# EAGLE design ADF Copy v0.5 (EAGLE 9.1.0)
CNAME: AKSevenFour; CREVISION: 0.4; DESIGNER: Adam Keher

## Sheet 1 of 4: Floppy Controller
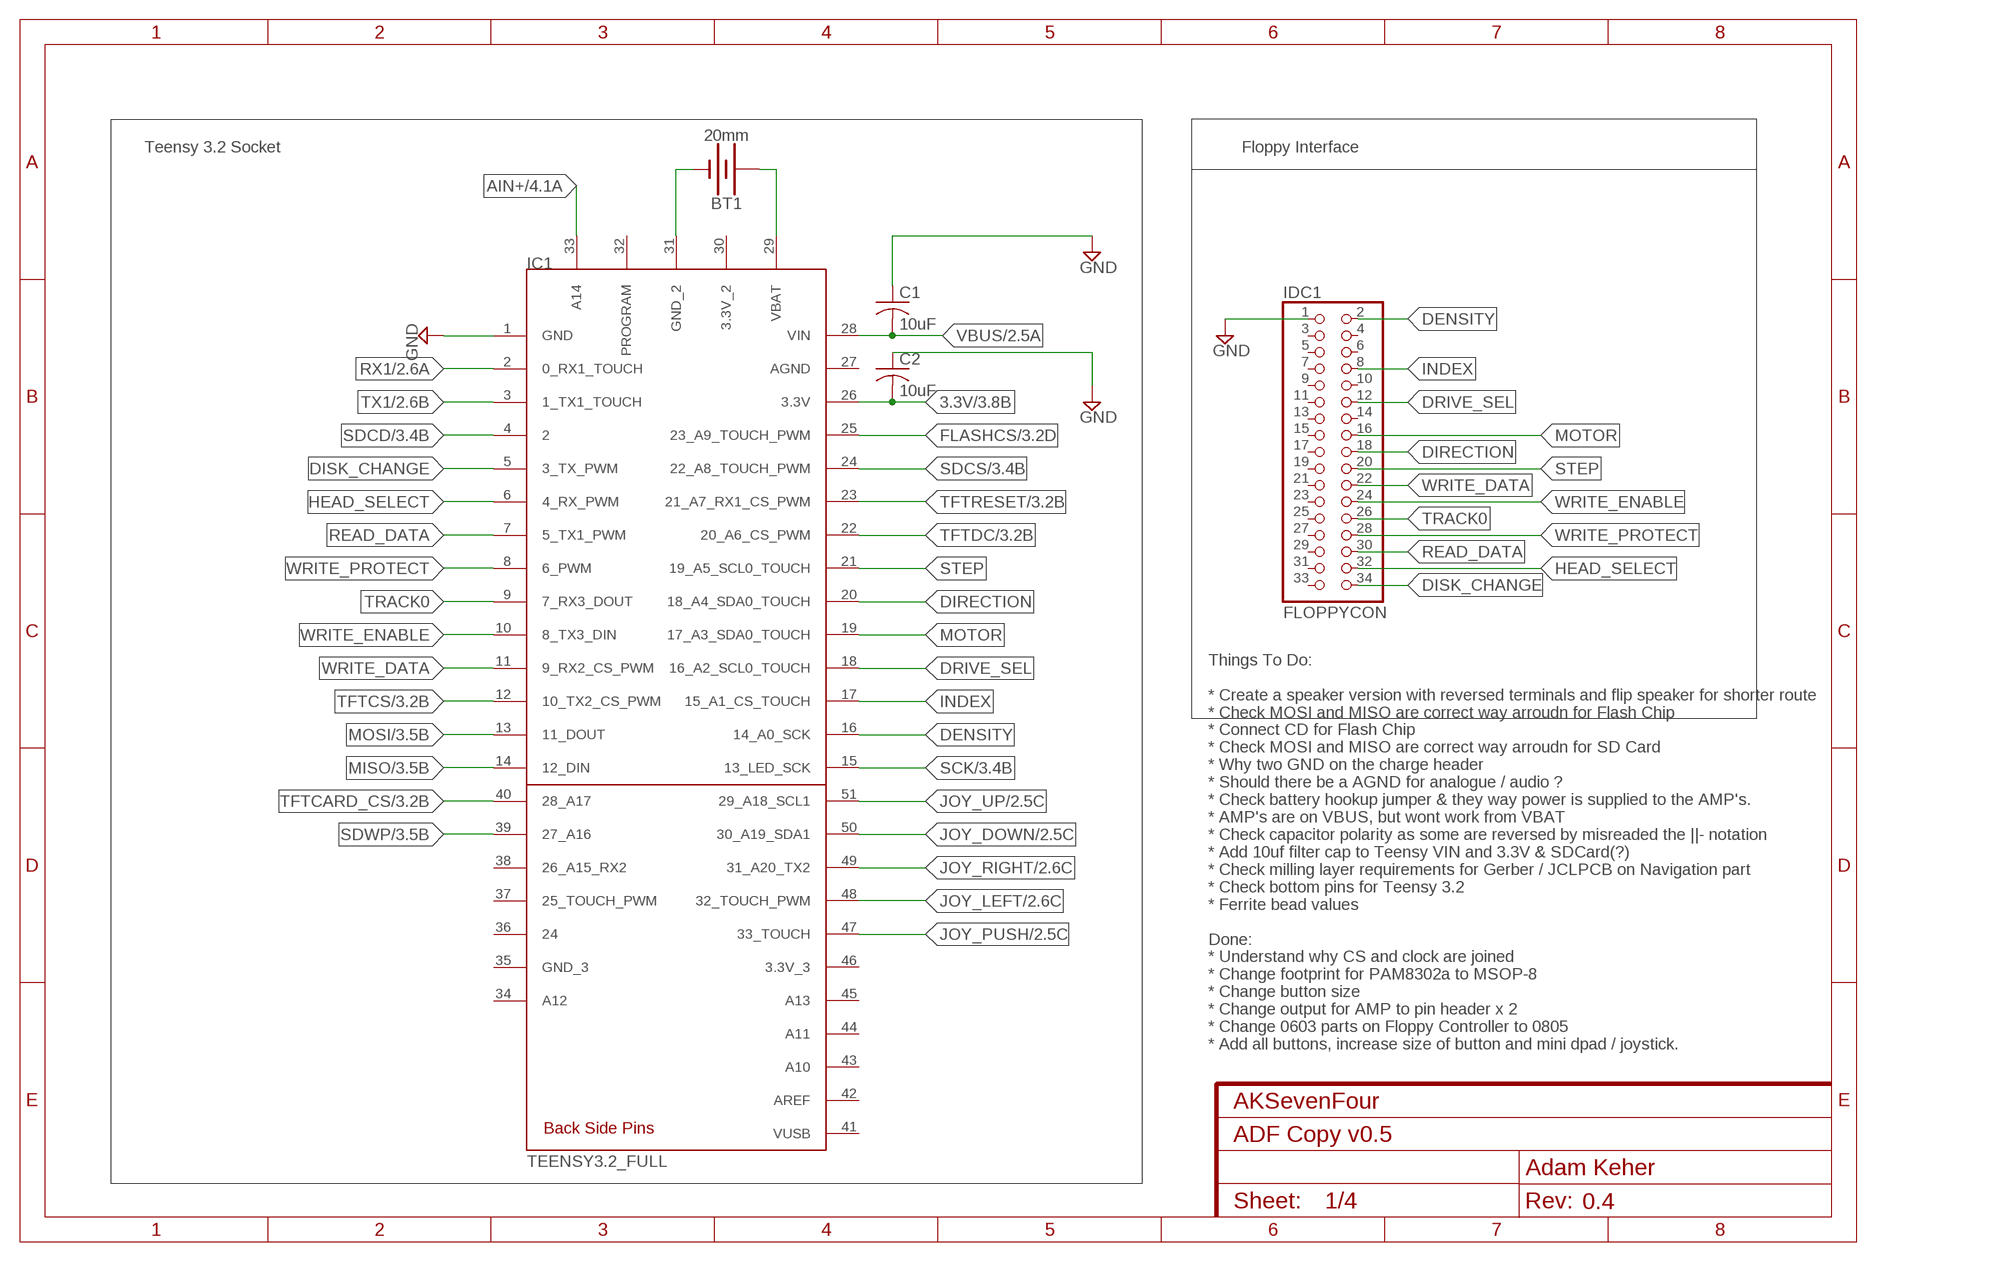
[diagram p0: schematic, sheet 1]

### Parts
BT1  20mm  BATTERY-20MM_PTH  [BATTCOM_20MM_PTH]
C1  10uF  C-USC0805  [C0805]
C2  10uF  C-USC0805  [C0805]
IC1  TEENSY3.2_FULL  [DIP28X4-2.54-34.7X15.24MM]
IDC1  FLOPPYCON  [2X17/90]

### Nets
3.3V [power1]: C2.2 IC1.26(3.3V) ; also sheet 3
AIN+: IC1.33(A14) ; also sheet 4
DENSITY: IC1.16(14_A0_SCK) IDC1.2
DIRECTION: IC1.20(18_A4_SDA0_TOUCH) IDC1.18
DISK_CHANGE: IC1.5(3_TX_PWM) IDC1.34
DRIVE_SEL: IC1.18(16_A2_SCL0_TOUCH) IDC1.12
FLASHCS: IC1.25(23_A9_TOUCH_PWM) ; also sheet 3
GND: C1.1 C2.1 IC1.1(GND) IDC1.1 ; also sheet 2,3,4
HEAD_SELECT: IC1.6(4_RX_PWM) IDC1.32
INDEX: IC1.17(15_A1_CS_TOUCH) IDC1.8
JOY_DOWN: IC1.50(30_A19_SDA1) ; also sheet 2
JOY_LEFT: IC1.48(32_TOUCH_PWM) ; also sheet 2
JOY_PUSH: IC1.47(33_TOUCH) ; also sheet 2
JOY_RIGHT: IC1.49(31_A20_TX2) ; also sheet 2
JOY_UP: IC1.51(29_A18_SCL1) ; also sheet 2
MISO: IC1.14(12_DIN) ; also sheet 3
MOSI: IC1.13(11_DOUT) ; also sheet 3
MOTOR: IC1.19(17_A3_SDA0_TOUCH) IDC1.16
N$7: BT1.2(-) IC1.31(GND_2)
N$8: BT1.1(+) IC1.29(VBAT)
READ_DATA: IC1.7(5_TX1_PWM) IDC1.30
RX1: IC1.2(0_RX1_TOUCH) ; also sheet 2
SCK: IC1.15(13_LED_SCK) ; also sheet 3
SDCD: IC1.4 ; also sheet 3
SDCS: IC1.24(22_A8_TOUCH_PWM) ; also sheet 3
SDWP: IC1.39(27_A16) ; also sheet 3
STEP: IC1.21(19_A5_SCL0_TOUCH) IDC1.20
TFTCARD_CS: IC1.40(28_A17) ; also sheet 3
TFTCS: IC1.12(10_TX2_CS_PWM) ; also sheet 3
TFTDC: IC1.22(20_A6_CS_PWM) ; also sheet 3
TFTRESET: IC1.23(21_A7_RX1_CS_PWM) ; also sheet 3
TRACK0: IC1.9(7_RX3_DOUT) IDC1.26
TX1: IC1.3(1_TX1_TOUCH) ; also sheet 2
VBUS [power2]: C1.2 IC1.28(VIN) ; also sheet 2,4
WRITE_DATA: IC1.11(9_RX2_CS_PWM) IDC1.22
WRITE_ENABLE: IC1.10(8_TX3_DIN) IDC1.24
WRITE_PROTECT: IC1.8(6_PWM) IDC1.28
Unconnected: IC1.27(AGND) IC1.30(3.3V_2) IC1.32(PROGRAM) IC1.34(A12) IC1.35(GND_3) IC1.36 IC1.37(25_TOUCH_PWM) IC1.38(26_A15_RX2) IC1.41(VUSB) IC1.42(AREF) IC1.43(A10) IC1.44(A11) IC1.45(A13) IC1.46(3.3V_3) IDC1.3 IDC1.4 IDC1.5 IDC1.6 IDC1.7 IDC1.9 IDC1.10 IDC1.11 IDC1.13 IDC1.14 IDC1.15 IDC1.17 IDC1.19 IDC1.21 IDC1.23 IDC1.25 IDC1.27 IDC1.29 IDC1.31 IDC1.33

### Notes on the sheet
- Teensy 3.2 Socket | Floppy Interface
- Things To Do:
  
  * Create a speaker version with reversed terminals and flip speaker for shorter route
  * Check MOSI and MISO are correct way arroudn for Flash Chip
  * Connect CD for Flash Chip
  * Check MOSI and MISO are correct way arroudn for SD Card
  * Why two GND on the charge header
  * Should there be a AGND for analogue / audio ?
  * Check battery hookup jumper & they way power is supplied to the AMP's.
  * AMP's are on VBUS, but wont work from VBAT
  * Check capacitor polarity as some are reversed by misreaded the ||- notation
  * Add 10uf filter cap to Teensy VIN and 3.3V & SDCard(?)
  * Check milling layer requirements for Gerber / JCLPCB on Navigation part
  * Check bottom pins for Teensy 3.2
  * Ferrite bead values
  
  Done:
  * Understand why CS and clock are joined
  * Change footprint for PAM8302a to MSOP-8
  * Change button size
  * Change output for AMP to pin header x 2
  * Change 0603 parts on Floppy Controller to 0805
  * Add all buttons, increase size of button and mini dpad / joystick.

## Sheet 2 of 4: Jumpers
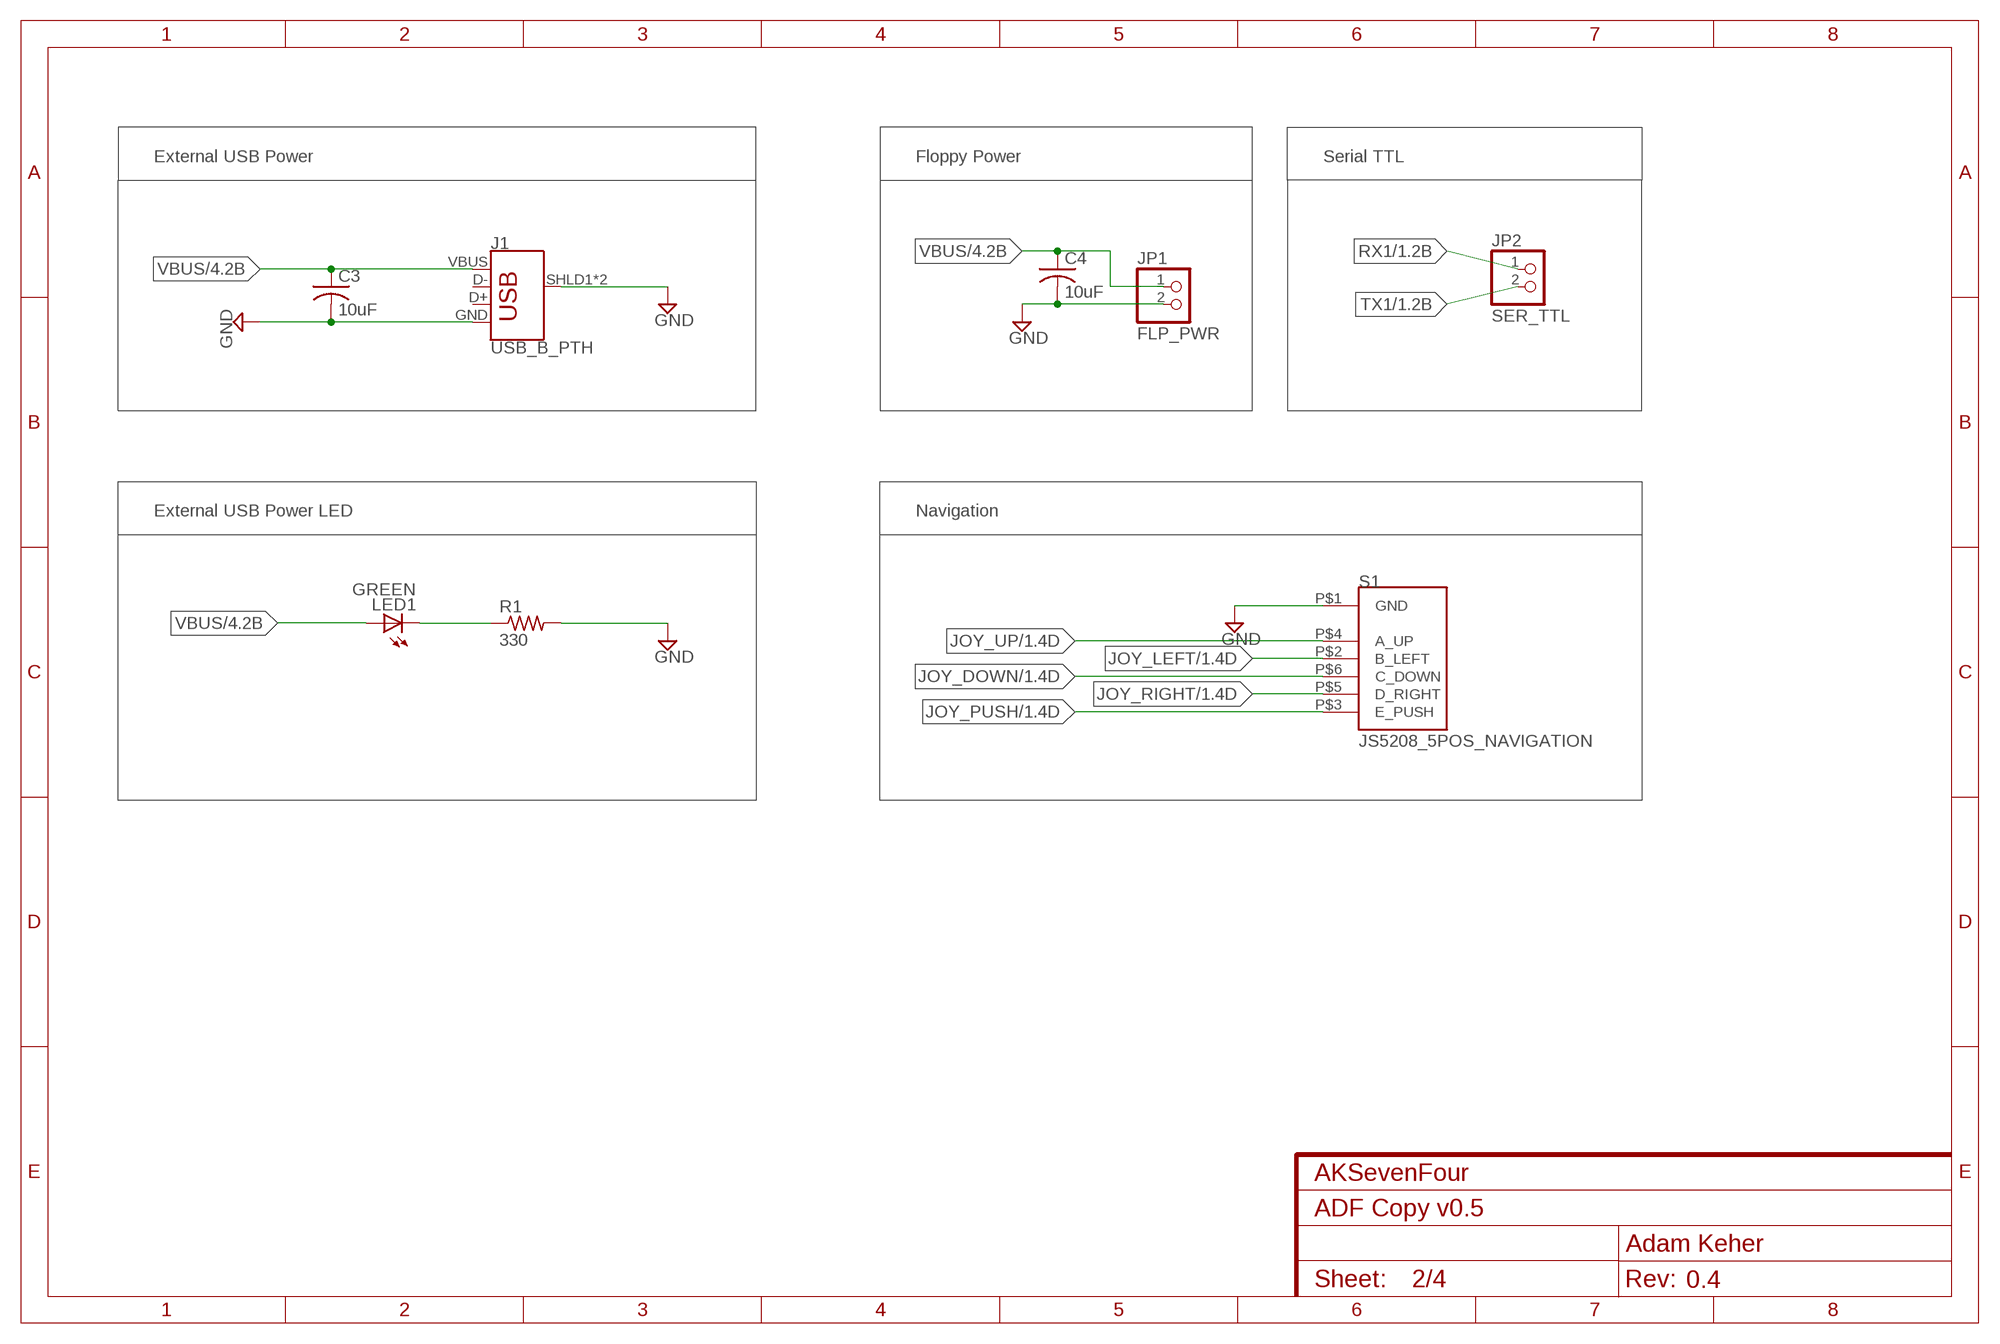
[diagram p1: schematic, sheet 2]

### Parts
C3  10uF  C-USC0805  [C0805]
C4  10uF  C-USC0805  [C0805]
J1  USB_B_PTH  [USB-B-PTH]
JP1  FLP_PWR  PINHD-1X2  [1X02]
JP2  SER_TTL  PINHD-1X2  [1X02]
LED1  GREEN  LEDCHIP-LED0805  [CHIP-LED0805]
R1  330  R-US_R0805  [R0805]
S1  JS5208_5POS_NAVIGATION  [JS5208_5POS_NAVIGATION]

### Nets
GND: C3.2 C4.2 J1.GND J1.SHLD1(SHIELD) J1.SHLD2(SHIELD) JP1.2 R1.2 S1.P$1(GND) ; also sheet 1,3,4
JOY_DOWN: S1.P$6(C_DOWN) ; also sheet 1
JOY_LEFT: S1.P$2(B_LEFT) ; also sheet 1
JOY_PUSH: S1.P$3(E_PUSH) ; also sheet 1
JOY_RIGHT: S1.P$5(D_RIGHT) ; also sheet 1
JOY_UP: S1.P$4(A_UP) ; also sheet 1
N$1: LED1.C R1.1
RX1: JP2.1 ; also sheet 1
TX1: JP2.2 ; also sheet 1
VBUS [power2]: C3.1 C4.1 J1.VBUS JP1.1 LED1.A ; also sheet 1,4
Unconnected: J1.D+ J1.D-

### Notes on the sheet
- External USB Power | Floppy Power | Serial TTL
- External USB Power LED | Navigation

## Sheet 3 of 4: TFT, SPI Flash & SD Card Reader
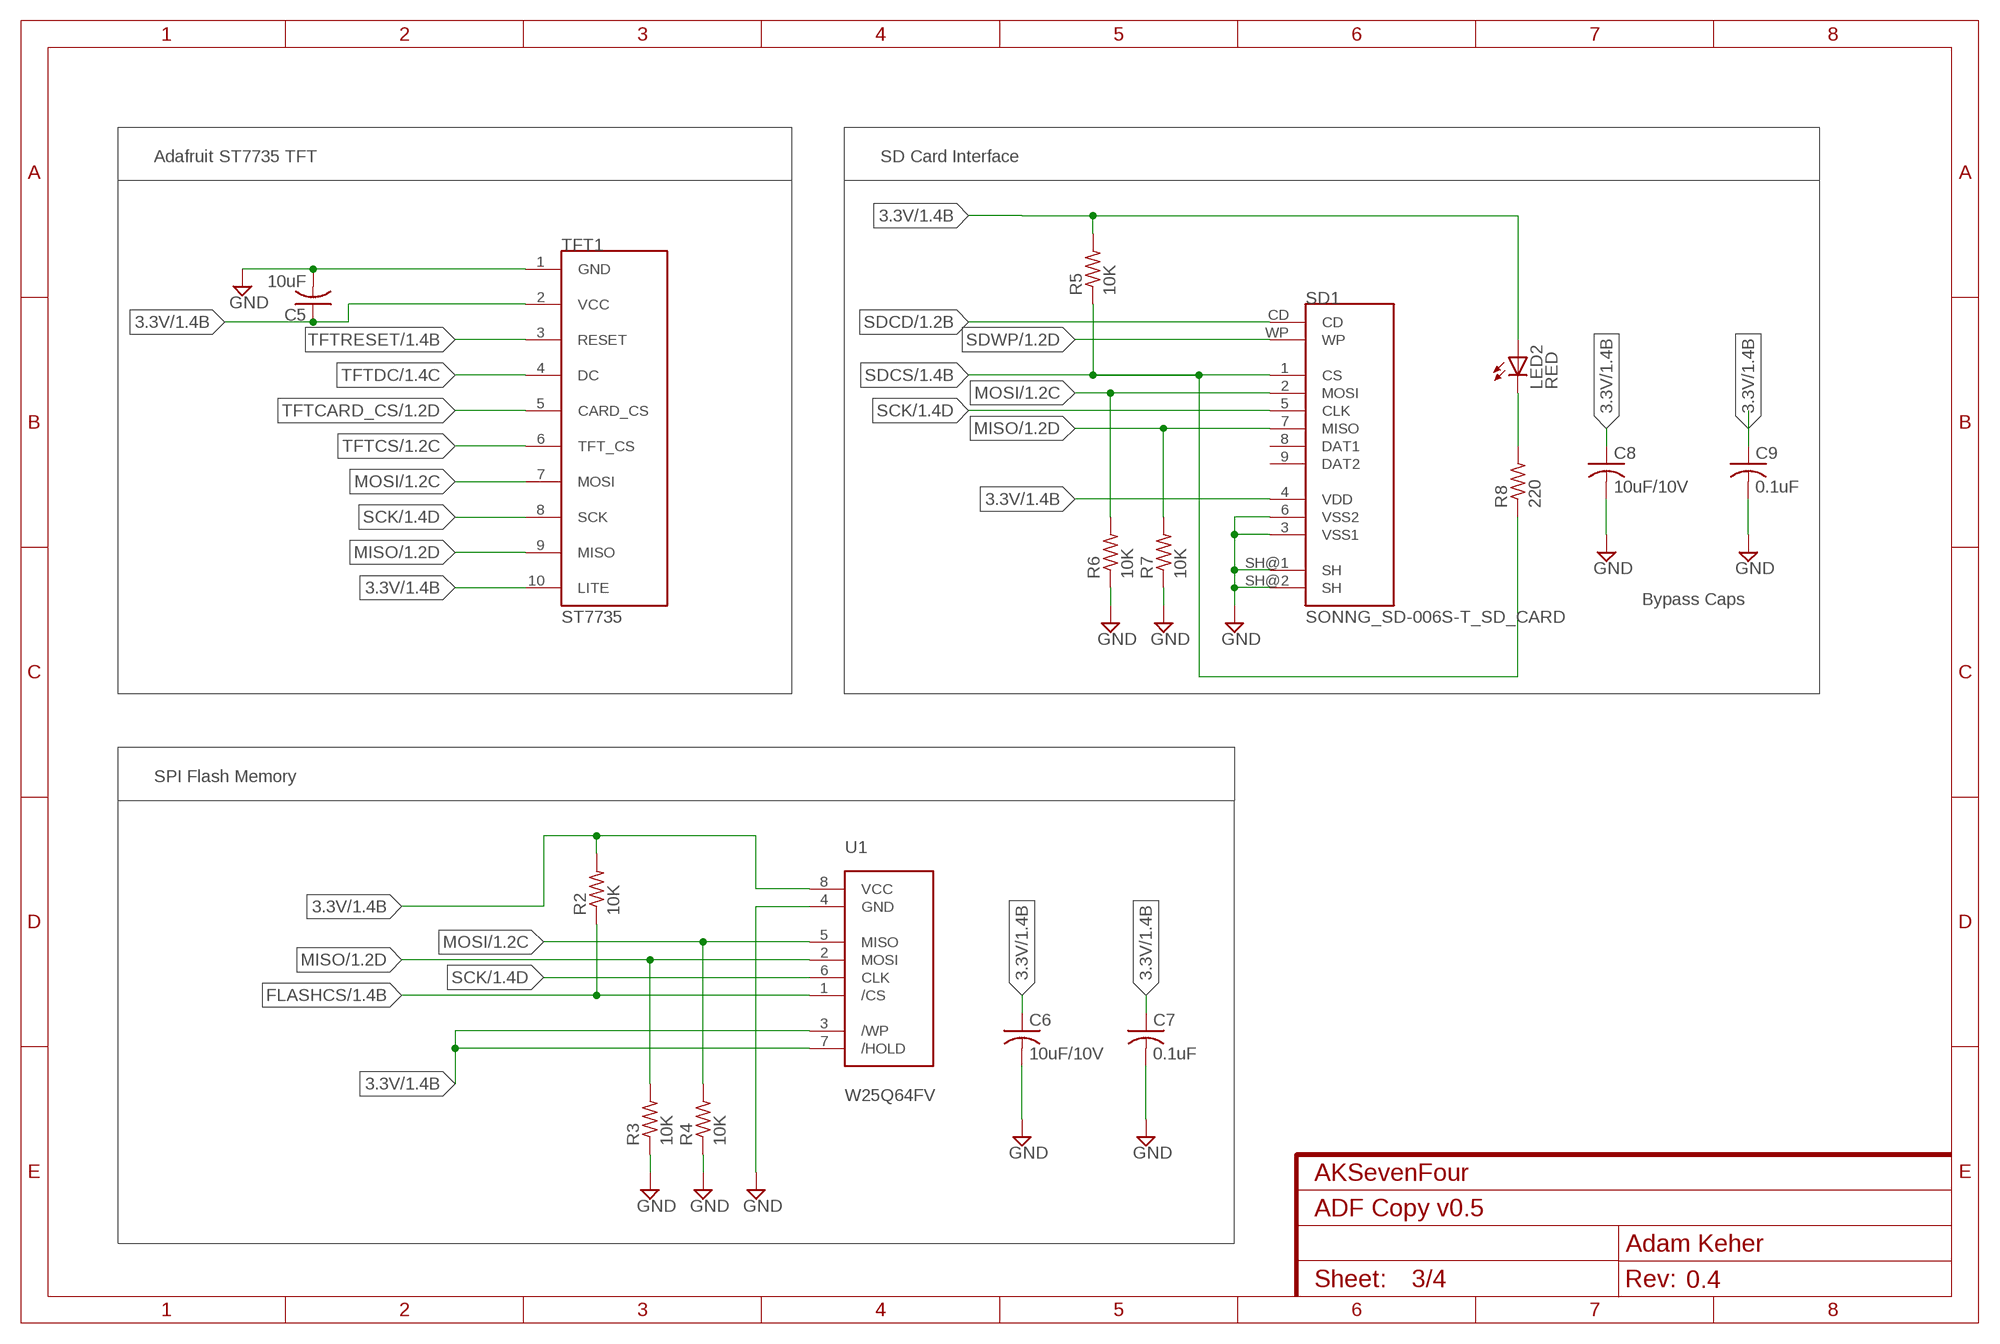
[diagram p2: schematic, sheet 3]

### Parts
C5  10uF  C-USC0805  [C0805]
C6  10uF/10V  C-USC0805  [C0805]
C7  0.1uF  C-USC0805  [C0805]
C8  10uF/10V  C-USC0805  [C0805]
C9  0.1uF  C-USC0805  [C0805]
LED2  RED  LEDCHIP-LED0805  [CHIP-LED0805]
R2  10K  R-US_R0805  [R0805]
R3  10K  R-US_R0805  [R0805]
R4  10K  R-US_R0805  [R0805]
R5  10K  R-US_R0805  [R0805]
R6  10K  R-US_R0805  [R0805]
R7  10K  R-US_R0805  [R0805]
R8  220  R-US_R0805  [R0805]
SD1  SONNG_SD-006S-T_SD_CARD  [SD-006S-T]
TFT1  ST7735  [ST7735]
U1  W25Q64FV  [SOIC8]

### Nets
3.3V [power1]: C5.1 C6.1 C7.1 C8.1 C9.1 LED2.A R2.2 R5.2 SD1.4(VDD) TFT1.2(VCC) TFT1.10(LITE) U1.3(/WP) U1.7(/HOLD) U1.8(VCC) ; also sheet 1
FLASHCS: R2.1 U1.1(/CS) ; also sheet 1
GND: C5.2 C6.2 C7.2 C8.2 C9.2 R3.1 R4.1 R6.1 R7.1 SD1.3(VSS1) SD1.6(VSS2) SD1.SH@1(SH) SD1.SH@2(SH) TFT1.1(GND) U1.4(GND) ; also sheet 1,2,4
MISO: R3.2 R7.2 SD1.7(MISO) TFT1.9(MISO) U1.2(MOSI) ; also sheet 1
MOSI: R4.2 R6.2 SD1.2(MOSI) TFT1.7(MOSI) U1.5(MISO) ; also sheet 1
N$15: LED2.C R8.2
SCK: SD1.5(CLK) TFT1.8(SCK) U1.6(CLK) ; also sheet 1
SDCD: SD1.CD ; also sheet 1
SDCS: R5.1 R8.1 SD1.1(CS) ; also sheet 1
SDWP: SD1.WP ; also sheet 1
TFTCARD_CS: TFT1.5(CARD_CS) ; also sheet 1
TFTCS: TFT1.6(TFT_CS) ; also sheet 1
TFTDC: TFT1.4(DC) ; also sheet 1
TFTRESET: TFT1.3(RESET) ; also sheet 1
Unconnected: SD1.8(DAT1) SD1.9(DAT2)

### Notes on the sheet
- Adafruit ST7735 TFT | SD Card Interface
- Bypass Caps
- SPI Flash Memory

## Sheet 4 of 4: Mono Amplifier
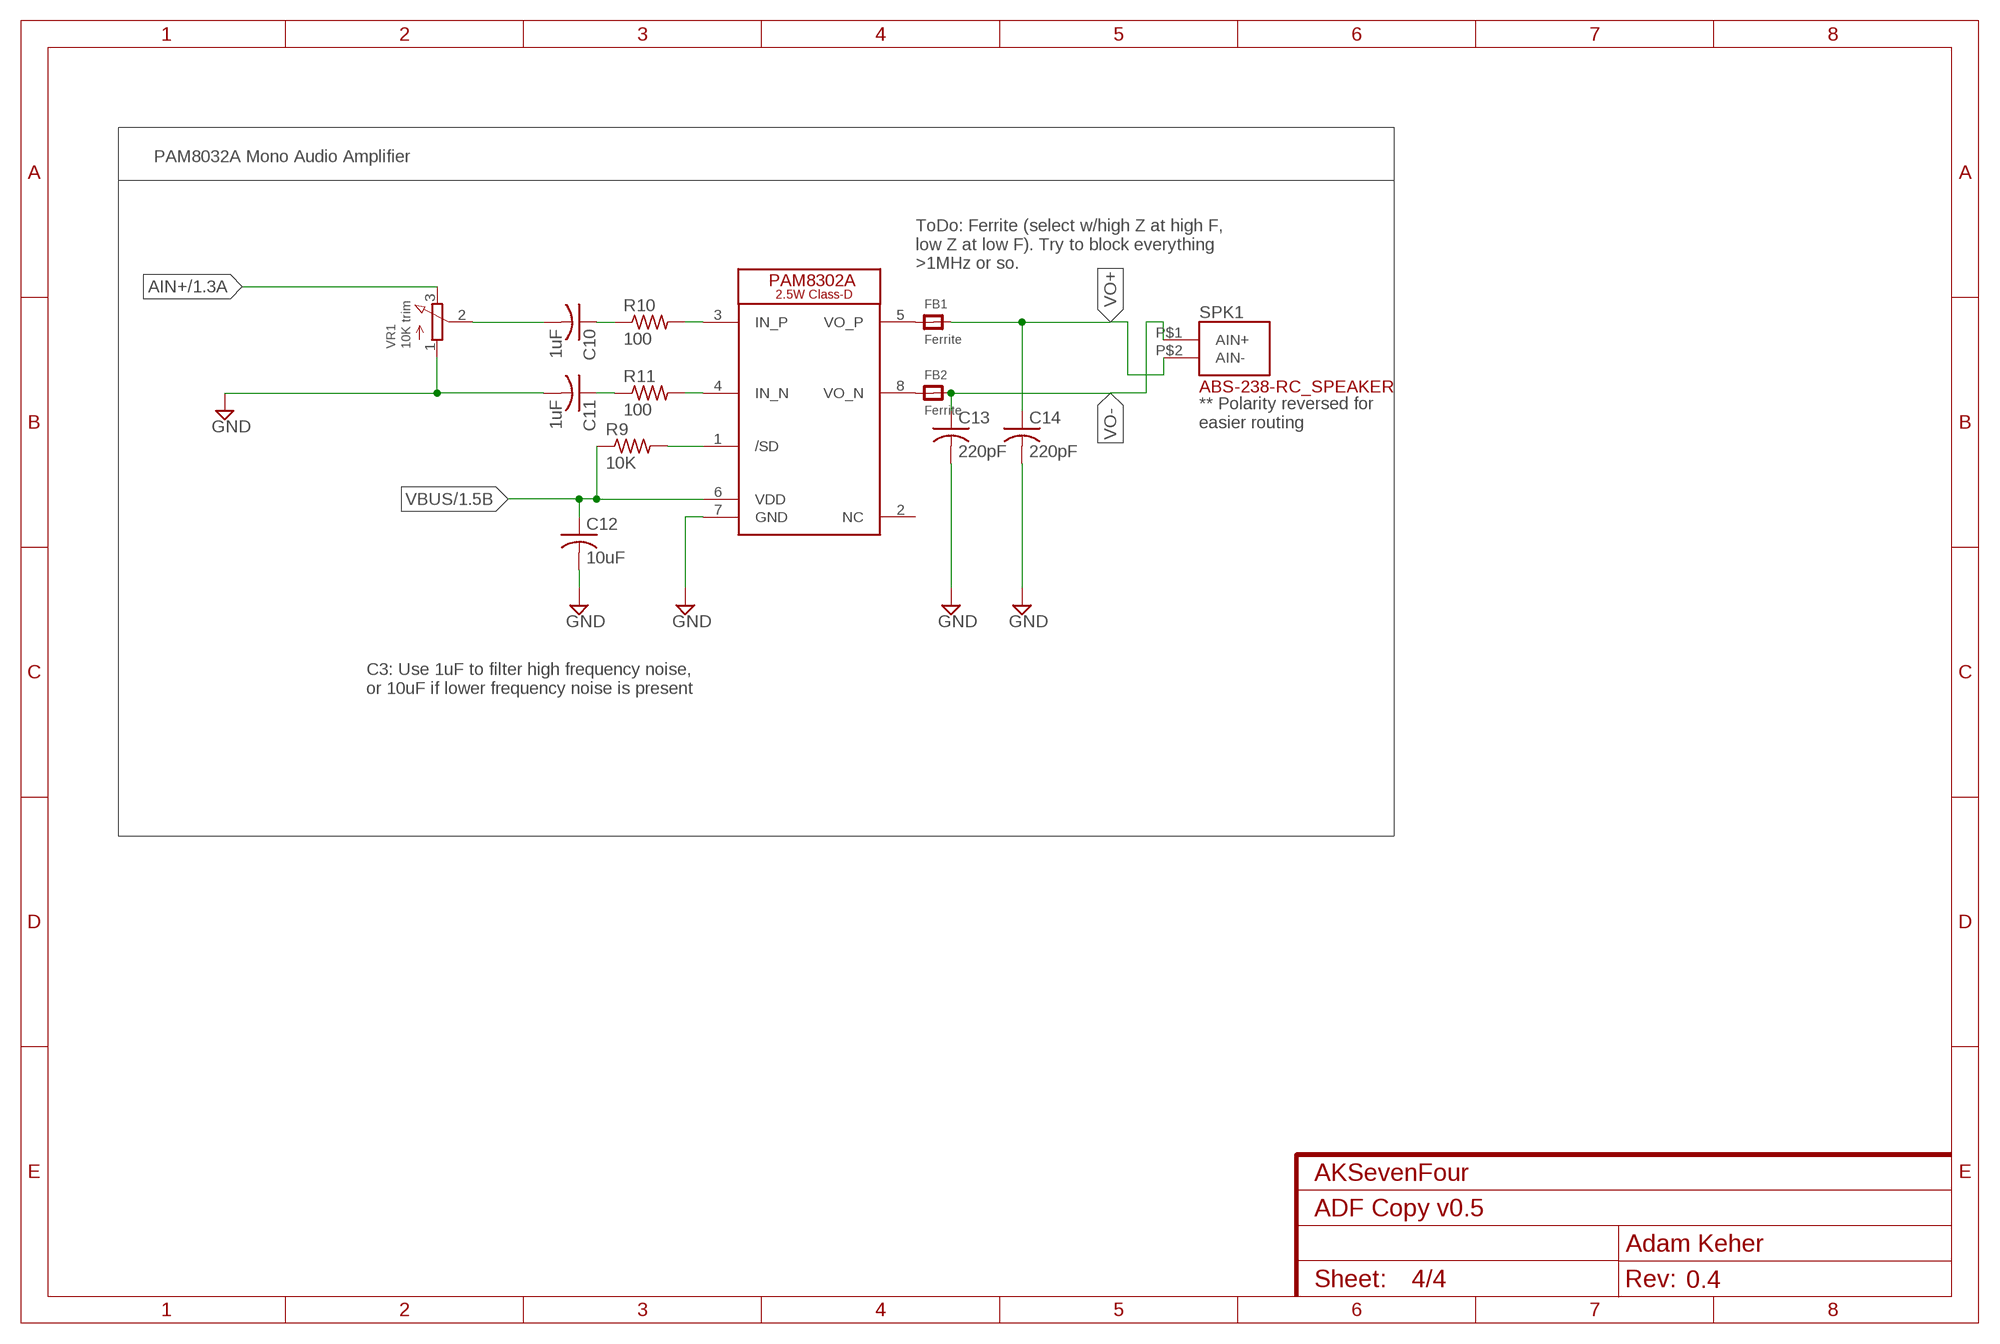
[diagram p3: schematic, sheet 4]

### Parts
C10  1uF  C-USC0805  [C0805]
C11  1uF  C-USC0805  [C0805]
C12  10uF  C-USC0805  [C0805]
C13  220pF  C-USC0805  [C0805]
C14  220pF  C-USC0805  [C0805]
FB1  Ferrite  FERRITE_0805  [_0805]
FB2  Ferrite  FERRITE_0805  [_0805]
IC2  PAM8302A  [SOIC8]
R9  10K  R-US_R0805  [R0805]
R10  100  R-US_R0805  [R0805]
R11  100  R-US_R0805  [R0805]
SPK1  ABS-238-RC_SPEAKER  [ABS-238-RC_SPEAKER]
VR1  10K trim  TRIMPOT3303W/X  [TRIMPOT_BOURNS_3303W]

### Nets
AIN+: VR1.3(E) ; also sheet 1
GND: C11.2 C12.2 C13.2 C14.2 IC2.7(GND) VR1.1(A) ; also sheet 1,2,3
N$3: IC2.1(/SD) R9.2
N$4: FB1.1 IC2.5(VO_P)
N$5: FB2.1 IC2.8(VO_N)
N$20: IC2.4(IN_N) R11.2
N$21: IC2.3(IN_P) R10.2
N$22: C11.1 R11.1
N$25: C10.1 R10.1
N$26: C10.2 VR1.2(S)
VBUS [power2]: C12.1 IC2.6(VDD) R9.1 ; also sheet 1,2
VO+: C14.1 FB1.2 SPK1.P$2(AIN-)
VO-: C13.1 FB2.2 SPK1.P$1(AIN+)
Unconnected: IC2.2(NC)

### Notes on the sheet
- PAM8032A Mono Audio Amplifier
- ToDo: Ferrite (select w/high Z at high F,
  low Z at low F). Try to block everything
  >1MHz or so.
- ** Polarity reversed for
  easier routing
- C3: Use 1uF to filter high frequency noise,
  or 10uF if lower frequency noise is present

## Library data of the parts
BT1 = SparkFun-Batteries:BATTERY: Battery - Single Cell A variety of battery chemistries, sizes, and footprints. Device List: 20MM_PTH - Coin Cell Battery Holder - 20mm (PTH) <https://www.sparkfun.com/products/783> 6.8MM_PTH - Coin Cell Battery Holder - 6.8MM(SMD) <https://www.digikey.com/product-detail/en/seiko-instruments/MS621FE-FL11E/728-1057-ND/1889208?WT.srch=1&gclid=CNOQ5a6LzdQCFZS2wAodXCkE0g> 12MM_SMD - Coin Cell Battery Holder - 12mm (SMD) <https://www.sparkfun.com/products/10592> 12MM_PTH - Coin Cell Battery Holder - 12mm (PTH) <https://www.sparkfun.com/products/7948> 20MM_SMD - 20mm Coin Cell Battery Holder (SMD) (2 legs) Used on the Big Time Watch Kit <https://www.sparkfun.com/products/11734> 20MM_SMD_4LEGS - Coin Cell Battery Holder - 20mm (SMD) <https://www.sparkfun.com/products/11892> 20MM_SMD_4LEGS_OVERPASTE - Coin Cell Battery Holder - 20mm (SMD) <https://www.sparkfun.com/products/11892> (Over-paste on the legs) 24.5MM_PTH - Coin Cell Battery Holder - 24.5mm (PTH) <https://www.sparkfun.com/products/8863> 9V - 9V Battery Holder - PC Mount Used on the SparkFun SparkPunk Sound Kit <https://www.sparkfun.com/products/11177> and SparkFun SparkPunk Sequencer Kit <https://www.sparkfun.com/products/12707> 18650 - Battery Holder - 18650 (PTH) <https://www.sparkfun.com/products/13113> AA - Battery Holder - 1xAA (PTH) <https://www.sparkfun.com/products/7949> AAA - Battery Holder - 1xAAA (PTH) <https://www.sparkfun.com/products/12718> AA_KIT - Battery Holder - 1xAA (PTH) <https://www.sparkfun.com/products/7949> Special kit package - pads only have exposed copper on one side of the board. AAA_KIT - Battery Holder - 1xAAA (PTH) <https://www.sparkfun.com/products/12718> Special kit package - pads only have exposed copper on one side of the board.; PROD_ID: BATT-09031; SF_SKU: PRT-00783
C1-C14 = rcl:C-US: CAPACITOR, American symbol; SPICEPREFIX: C
FB1 FB2 = microbuilder:FERRITE: Ferrite Bead 0603 MMZ1608B121C - 120 Ohm @ 100MHz, 600mA, 0.15 Ohm DC Resistance - Digikey: 445-2164-1-ND BK1608HW121-T - 120 Ohm, 600mA Ferrite Chip - Digikey: 587-1876-2-ND 0805 HZ0805B272R-10 - 2.7K Ohm @ 100MHz, 200mA, 0.8 Ohm DC Resistance - Digikey: 240-2504-1-ND (see also Murata BLM21BD272SN1L) MMZ2012Y152B - 1.5K Ohm @ 100MHz, 500mA, 0.4 Ohm DC Resistance - Digikey: 445-1560-1-ND - Mainly for high frequency (80-400MHz) MMZ2012R102A - 1K Ohm @ 100MHz, 500mA, 0.3 Ohm DC Resistance - Digikey: 445-1555-2-ND - More general purpose (10-200MHz)
IC1 = AK74:TEENSY3.2_FULL
IC2 = AK74:PAM8302A
IDC1 = AK74:FLOPPYCON
J1 = SparkFun-Connectors:USB_B: USB Type B Connector SparkFun Products: SparkFun Stepoko <https://www.sparkfun.com/products/13899> PTH; PROD_ID: CONN-08278; SF_ID: PRT-00139
JP1 JP2 = pinhead:PINHD-1X2: PIN HEADER
LED1 LED2 = led:LED: LED OSRAM: - CHIPLED LG R971, LG N971, LY N971, LG Q971, LY Q971, LO R971, LY R971 LH N974, LH R974 LS Q976, LO Q976, LY Q976 LO Q996 - Hyper CHIPLED LW Q18S LB Q993, LB Q99A, LB R99A - SideLED LS A670, LO A670, LY A670, LG A670, LP A670 LB A673, LV A673, LT A673, LW A673 LH A674 LY A675 LS A676, LA A676, LO A676, LY A676, LW A676 LS A679, LY A679, LG A679 - Hyper Micro SIDELED® LS Y876, LA Y876, LO Y876, LY Y876 LT Y87S - SmartLED LW L88C, LW L88S LB L89C, LB L89S, LG L890 LS L89K, LO L89K, LY L89K LS L896, LA L896, LO L896, LY L896 - TOPLED LS T670, LO T670, LY T670, LG T670, LP T670 LSG T670, LSP T670, LSY T670, LOP T670, LYG T670 LG T671, LOG T671, LSG T671 LB T673, LV T673, LT T673, LW T673 LH T674 LS T676, LA T676, LO T676, LY T676, LB T676, LH T676, LSB T676, LW T676 LB T67C, LV T67C, LT T67C, LS T67K, LO T67K, LY T67K, LW E67C LS E67B, LA E67B, LO E67B, LY E67B, LB E67C, LV E67C, LT E67C LW T67C LS T679, LY T679, LG T679 LS T770, LO T770, LY T770, LG T770, LP T770 LB T773, LV T773, LT T773, LW T773 LH T774 LS E675, LA E675, LY E675, LS T675 LS T776, LA T776, LO T776, LY T776, LB T776 LHGB T686 LT T68C, LB T68C - Hyper Mini TOPLED® LB M676 - Mini TOPLED Santana® LG M470 LS M47K, LO M47K, LY M47K Source: http://www.osram.convergy.de LUXEON: - LUMILED® LXK2-PW12-R00, LXK2-PW12-S00, LXK2-PW14-U00, LXK2-PW14-V00 LXK2-PM12-R00, LXK2-PM12-S00, LXK2-PM14-U00 LXK2-PE12-Q00, LXK2-PE12-R00, LXK2-PE12-S00, LXK2-PE14-T00, LXK2-PE14-U00 LXK2-PB12-K00, LXK2-PB12-L00, LXK2-PB12-M00, LXK2-PB14-N00, LXK2-PB14-P00, LXK2-PB14-Q00 LXK2-PR12-L00, LXK2-PR12-M00, LXK2-PR14-Q00, LXK2-PR14-R00 LXK2-PD12-Q00, LXK2-PD12-R00, LXK2-PD12-S00 LXK2-PH12-R00, LXK2-PH12-S00 LXK2-PL12-P00, LXK2-PL12-Q00, LXK2-PL12-R00 Source: www.luxeon.com KINGBRIGHT: KA-3528ASYC Source: www.kingbright.com
R1-R11 = resistor:R-US_: RESISTOR, American symbol
S1 = AK74:JS5208_5POS_NAVIGATION
SD1 = AK74:SONNG_SD-006S-T_SD_CARD
SPK1 = AK74:ABS-238-RC_SPEAKER
TFT1 = AK74:ST7735
U1 = AK74:W25Q64FV
VR1 = microbuilder:TRIMPOT: 3-Pin SMT Trimpots Bourns TC33 (X-2) Series 1K - Digikey: TC33X-102ECT-ND 10K - Digikey: TC33X-2-103E 100K - Digikey: TC33X-104ECT-ND Bourns 3303 (W) Series 3mm 10K Single Turn - Digikey: 3303W-103ETR-ND 3mm 100K Single Turn - Digikey: 3303X-104ETR-ND

## Net classes
1 power1: width 0.3 mm
2 power2: width 0.35 mm

## Board
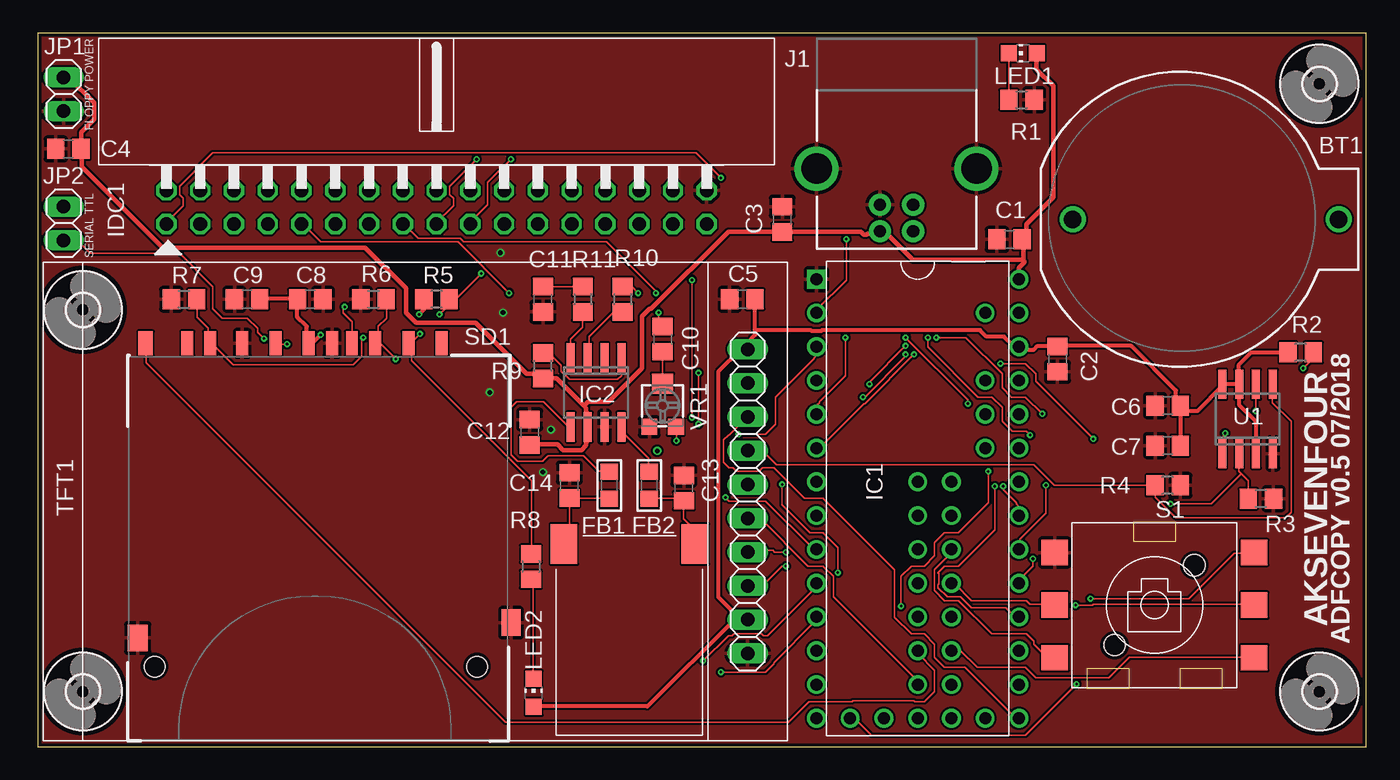
[diagram p4: board, top side]
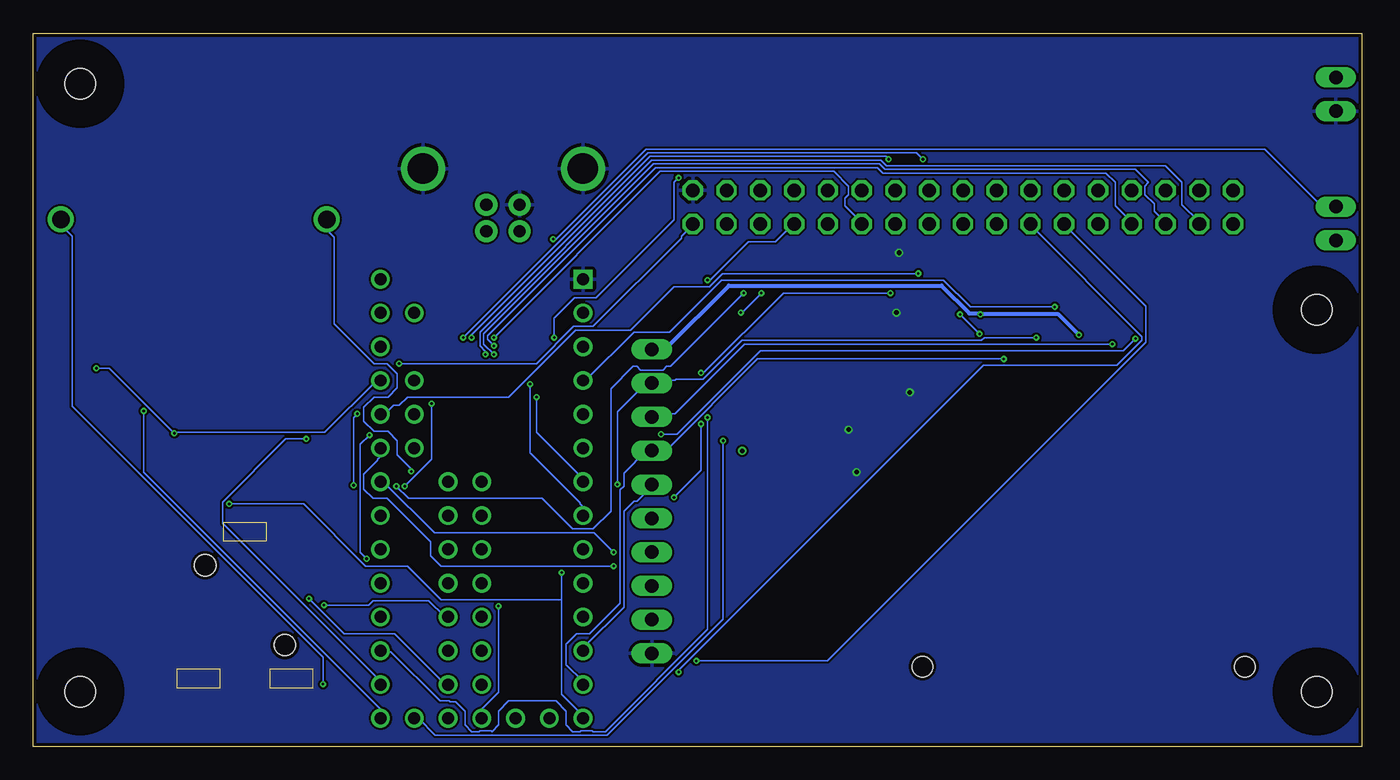
[diagram p5: board, bottom side, seen from below]

Size 99.93 x 53.64 mm. Coordinates in mm from the lower left corner, seen from the top.
Outline: 0,0 99.93,0 99.93,53.64 0,53.64 0,0
Copper layers (1*16): Top 0.07mm / dielectric 1.5mm / Bottom 0.07mm
Design rules "jlcpcb-2layer": minimum track width 5mil, minimum drill 0.2mm, track to track 6mil, track to pad 6mil, pad to pad 6mil, via to via 6mil, smd to smd 6mil, copper to edge 10mil, drill to drill 5mil, minimum pad ring 10mil, minimum via ring 5mil, stop-mask expansion 2mil, vias tented up to drill 0mil, thermal gap 10mil

### Footprints (pad centres in the part's own frame; a part is rotated, then mirrored left to right if it is on the bottom)
BATTCOM_20MM_PTH = drill 1.3: 1 11.85,0; 2 -8.15,0
C0805 = smd 1.3 x 1.5: 1 -0.95,0; 2 0.95,0
_0805 = smd 1.2 x 1.3: 1 -1.016,0; 2 1.016,0
DIP28X4-2.54-34.7X15.24MM = drill 0.9 pad 1.4 square: 1 -16.51,-11.43 | drill 0.9 pad 1.4: 2 -13.97,-11.43; 3 -11.43,-11.43; 4 -8.89,-11.43; 5 -6.35,-11.43; 6 -3.81,-11.43; 7 -1.27,-11.43; 8 1.27,-11.43; 9 3.81,-11.43; 10 6.35,-11.43; 11 8.89,-11.43; 12 11.43,-11.43; 13 13.97,-11.43; 14 16.51,-11.43; 15 16.51,3.81; 16 13.97,3.81; 17 11.43,3.81; 18 8.89,3.81; 19 6.35,3.81; 20 3.81,3.81; 21 1.27,3.81; 22 -1.27,3.81; 23 -3.81,3.81; 24 -6.35,3.81; 25 -8.89,3.81; 26 -11.43,3.81; 27 -13.97,3.81; 28 -16.51,3.81; 29 16.51,-8.89; 30 16.51,-6.35; 31 16.51,-3.81; 32 16.51,-1.27; 33 16.51,1.27; 34 -1.27,-3.81; 35 1.27,-3.81; 36 3.81,-3.81; 37 6.35,-3.81; 38 8.89,-3.81; 39 11.43,-3.81; 40 13.97,-3.81; 41 -13.97,1.27; 42 -8.89,1.27; 43 -6.35,1.27; 44 -3.81,1.27; 45 -1.27,-1.27; 46 1.27,-1.27; 47 3.81,-1.27; 48 6.35,-1.27; 49 8.89,-1.27; 50 11.43,-1.27; 51 13.97,-1.27
SOIC8 = smd 0.6 x 2.2: 1 -1.905,-2.6; 2 -0.635,-2.6; 3 0.635,-2.6; 4 1.905,-2.6; 5 1.905,2.6; 6 0.635,2.6; 7 -0.635,2.6; 8 -1.905,2.6
2X17/90 = drill 1.016 octagon: 1 20.32,-3.81; 2 20.32,-6.35; 3 17.78,-3.81; 4 17.78,-6.35; 5 15.24,-3.81; 6 15.24,-6.35; 7 12.7,-3.81; 8 12.7,-6.35; 9 10.16,-3.81; 10 10.16,-6.35; 11 7.62,-3.81; 12 7.62,-6.35; 13 5.08,-3.81; 14 5.08,-6.35; 15 2.54,-3.81; 16 2.54,-6.35; 17 0,-3.81; 18 0,-6.35; 19 -2.54,-3.81; 20 -2.54,-6.35; 21 -5.08,-3.81; 22 -5.08,-6.35; 23 -7.62,-3.81; 24 -7.62,-6.35; 25 -10.16,-3.81; 26 -10.16,-6.35; 27 -12.7,-3.81; 28 -12.7,-6.35; 29 -15.24,-3.81; 30 -15.24,-6.35; 31 -17.78,-3.81; 32 -17.78,-6.35; 33 -20.32,-3.81; 34 -20.32,-6.35
USB-B-PTH = drill 0.914 pad 1.676: D+ 4,1.25; D- 5.981,1.25; GND 4,-1.25; VBUS 5.981,-1.25 | drill 2.286: SHLD1 1.282,-6.02; SHLD2 1.282,6.02
1X02 = drill 1.016 long: 1 -1.27,0; 2 1.27,0
CHIP-LED0805 = smd 1.2 x 1.2: A 0,-1.05; C 0,1.05
R0805 = smd 1.3 x 1.5: 1 -0.95,0; 2 0.95,0
JS5208_5POS_NAVIGATION = smd 2 x 1.9: P$1 -7.5,3.95; P$2 -7.5,0; P$3 -7.5,-3.95; P$4 7.5,3.95; P$5 7.5,0; P$6 7.5,-3.95 | hole 1.6: 3,3; -3,-3
SD-006S-T = smd 0.9 x 1.8: 1 6.28,14.98; 2 3.78,14.98; 3 0.53,14.98; 4 -1.22,14.98; 5 -3.72,14.98; 6 -6.22,14.98; 7 -8.64,14.98; 8 -10.34,14.98; 9 8.78,14.98; CD 2.03,14.98 | smd 1.4 x 2: SH@1 14.006,-6.02 | smd 1.527 x 2: SH@2 -14.079,-7.17 | smd 1.1 x 1.8: WP -13.49,14.98 | hole 1.55: 11.45,-9.32; -12.81,-9.32
ABS-238-RC_SPEAKER = smd 2 x 3: P$1 -4.925,-6.9; P$2 4.925,-6.9
ST7735 = drill 1.016 long: 1 -11.43,0; 2 -8.89,0; 3 -6.35,0; 4 -3.81,0; 5 -1.27,0; 6 1.27,0; 7 3.81,0; 8 6.35,0; 9 8.89,0; 10 11.43,0
M2_HOLE = hole 2.3: 0,0
TRIMPOT_BOURNS_3303W = smd 1.2 x 1.2: 1 -1,-1.6; 3 1,-1.6 | smd 1.6 x 1.5: 2 0,1.65

### Placement (x,y rotation side)
BT1  86,39.64 0 top
C1  73.1,38.14 0 top
C2  76.7,29.14 90 top
C3  56,39.64 90 top
C4  2.3,44.94 180 top
C5  53,33.64 180 top
C6  85,25.64 180 top
C7  85,22.64 180 top
C8  20.5,33.64 0 top
C9  15.75,33.64 180 top
C10  47,30.64 270 top
C11  38,33.64 270 top
C12  37,23.64 90 top
C13  48.6,19.44 90 top
C14  40,19.64 90 top
FB1  43,19.64 270 top
FB2  46,19.64 270 top
IC1  70,18.64 270 top
IC2  42,26.64 180 top
IDC1  30,45.64 0 top
J1  64.6,44.74 270 top
JP1  1.95,49.05 270 top
JP2  1.95,39.34 270 top
LED1  74.1,52.14 90 top
LED2  37.3,4.04 0 top
R1  74,48.64 0 top
R2  95,29.64 180 top
R3  92,18.64 180 top
R4  85,19.64 180 top
R5  30,33.64 180 top
R6  25.25,33.64 0 top
R7  11,33.64 0 top
R8  37.1,13.54 270 top
R9  38,28.64 90 top
R10  44,33.64 270 top
R11  41,33.64 270 top
S1  84,10.64 0 top
SD1  21.6,15.34 0 top
SPK1  44.5,8.34 180 top
TFT1  53.4,18.44 90 top
U1  91,24.64 0 top
U$1  [M2_HOLE]  3.4,4.14 0 top
U$2  [M2_HOLE]  3.4,32.84 0 top
U$3  [M2_HOLE]  96.4,49.84 0 top
U$4  [M2_HOLE]  96.4,4.14 0 top
VR1  47,25.64 0 top

### Tracks (layer width: path | path; a pad name or v marks a point on that pad's centre or on a via)
3.3V  (via drill 0.2)
  Top 0.3: LED2.A 37.34,3.02 45.87,3.02 52.36,9.52 53.34,9.52 TFT1.2 52.36,9.66 52.36,10.08 51.17,11.27 51.17,28.17 52.85,29.85 53.27,29.85 TFT1.10 53.41,29.92 53.41,30.41 53.97,30.96 53.97,31.31 | C9.1 16.74,33.69 19.53,33.69 C8.1 19.53,33.55 19.53,32.29 20.23,31.59 20.23,30.61 20.37,30.47 SD1.4 20.44,30.33 20.65,30.33 v21.28,30.96 | v28.68,32.5 29.03,32.85 29.03,33.62 R5.2 | 53.97,31.31 53.97,33.62 C5.1 | C7.1 85.96,22.65 85.96,25.58 C6.1 | R2.2 93.99,29.64 91.27,29.64 90.36,28.73 90.36,27.26 U1.7 | U1.3 91.62,22.09 91.62,24.47 90.36,25.72 90.36,27.12 U1.7 | U1.7 90.22,27.26 89.1,27.26 U1.8 89.1,27.12 87.22,25.24 86.1,25.24 C6.1 | C6.1 85.96,25.8 85.61,26.14 85.61,26.77 82.26,30.13 76.81,30.13 C2.2 76.67,30.13 75.2,30.13 74.92,29.85 74.5,29.85 74.3,30.06 73.88,30.06 IC1.26 73.67,30.06 73.46,30.06 72.69,30.82 71.36,30.82 70.87,31.31 59,31.31 58.93,31.24 58.23,31.24 58.16,31.31 54.11,31.31 53.97,31.31
  Bottom 0.3: v21.28,30.96 22.82,32.5 v28.68,32.5 28.82,32.57 29.52,32.57 31.62,34.67 47.61,34.67 52.36,29.92 53.34,29.92 TFT1.10
AIN+  (via drill 0.2)
  Top 0.127: v48.03,23 48.03,23.98 VR1.3
  Bottom 0.127: v48.03,23 48.03,9.59 56.76,0.86 69.69,0.86 70.94,2.12 71.22,2.12 IC1.33
DENSITY  (via drill 0.2)
  Top 0.127: v79.39,23.14 75.06,27.47 75.06,28.03 74.3,28.8 v72.41,28.8
  Bottom 0.127: v79.39,23.14 80.93,23.14 85.68,18.39 85.68,16.78 73.88,4.98 73.88,4.7 IC1.16 | v72.41,28.8 62.07,28.8 59.28,31.59 57.81,31.59 51.17,38.23 51.17,38.37 50.27,39.28 IDC1.2
DIRECTION  (via drill 0.2)
  Top 0.127: v75.83,19.65 75.83,17.55 73.88,15.6 73.88,14.9 IC1.20 | v75.55,25.03 74.3,26.28 73.25,26.28 72.55,26.98 72.55,28.03 69.82,30.75 v67.59,30.75 | v33.01,44.17 30.99,42.14 30.99,41.51 31.27,41.23 31.27,40.67 29.94,39.35 IDC1.18
  Bottom 0.127: v75.83,19.65 75.83,24.75 v75.55,25.03 | v67.59,30.75 53.69,44.66 33.5,44.66 v33.01,44.17
DISK_CHANGE  (via drill 0.2)
  Top 0.127: v60.74,30.75 60.74,27.89 58.79,25.94 58.79,25.86 58.58,25.66 58.58,25.03 IC1.5 | v51.38,42.77 49.5,44.66 13.18,44.66 10.66,42.14 10.66,41.51 10.94,41.23 10.94,40.67 9.61,39.35 IDC1.34
  Bottom 0.127: v60.74,30.75 60.74,32.22 59.21,33.76 57.6,33.76 51.73,39.62 51.73,42.42 v51.38,42.77
DRIVE_SEL  (via drill 0.2)
  Top 0.127: v71.99,19.58 71.99,16.3 69.27,13.57 68.22,13.57 67.73,13.08 67.8,13.01 67.8,12.24 67.73,12.17 67.73,11.97 68.43,11.27 69.41,11.27 70.24,10.43 72.83,10.43 73.46,9.8 73.81,9.8 IC1.18 | v69.96,25.8 69.96,26.07 v65.28,30.75
  Bottom 0.127: v71.99,19.58 69.96,21.6 v69.96,25.8 | v65.28,30.75 52.78,43.26 39.72,43.26 38.6,42.14 38.6,41.51 38.88,41.23 38.88,40.67 37.55,39.35 IDC1.12
FLASHCS  (via drill 0.2)
  Top 0.127: v95.18,28.45 95.95,29.22 R2.1 | v89.31,23.56 89.17,23.42 89.17,22.16 89.1,22.09 U1.1
  Bottom 0.127: v95.18,28.45 94.2,28.45 v89.31,23.56 89.31,23.63 78,23.63 74.16,27.47 73.88,27.47 IC1.25
GND  (via drill 0.35)
  other vias: 38,20.64 38.6,23.84 34,26.64 34.8,37.14 35,32.64
  pour Bottom: -10,59.64 -10,-5.36 105,-5.36 105,59.64
  pour Top: -7,56.64 -7,-3.36 102,-3.36 102,56.64
HEAD_SELECT  (via drill 0.2)
  Top 0.127: v65.91,29.5 62.21,25.8 62.14,25.8 58.86,22.51 58.58,22.51 IC1.6
  Bottom 0.127: v65.91,29.5 65.91,29.71 66.33,30.13 66.33,31.17 53.41,44.1 36.16,44.1 35.74,43.68 14.78,43.68 13.53,42.42 13.53,40.74 12.27,39.49 12.27,39.35 IDC1.32
INDEX  (via drill 0.2)
  Top 0.127: v49.22,35.08 v49.22,24.75
  Bottom 0.127: v49.22,24.75 49.22,8.82 56.9,1.14 57.81,1.14 57.88,1.21 58.72,1.21 58.79,1.14 59.35,1.14 59.84,1.63 59.84,2.67 60.6,3.44 64.17,3.44 64.94,2.67 64.94,1.63 65.42,1.14 65.49,1.21 66.33,1.21 66.4,1.14 66.96,1.14 67.45,1.63 67.45,2.67 68.15,3.37 68.57,3.37 68.64,3.44 69.33,3.44 73.04,7.15 73.81,7.15 IC1.17 | v49.22,35.08 49.01,35.08 46.15,37.95 44.12,37.95 42.72,39.35 IDC1.8
JOY_DOWN
  Top 0.127: S1.P$6 91.48,6.73 82.12,6.73 80.58,5.19 75.06,5.19 74.3,5.96 70.66,5.96 69.41,7.22 68.78,7.22 IC1.50
JOY_LEFT
  Top 0.127: S1.P$2 76.46,10.71 74.64,10.71 74.36,10.99 70.24,10.99 68.99,12.24 68.78,12.24 IC1.48
JOY_PUSH
  Top 0.127: S1.P$3 76.46,6.73 75.9,6.73 74.92,7.7 74.92,7.91 74.36,8.47 71.78,8.47 69.27,10.99 68.22,10.99 67.45,11.76 67.45,13.29 68.71,14.55 68.71,14.83 IC1.47
JOY_RIGHT  (via drill 0.2)
  Top 0.127: v78.07,10.64 79.32,10.64 79.39,10.71 91.48,10.71 S1.P$5
  Bottom 0.127: v78.07,10.64 74.71,10.64 74.36,10.99 70.17,10.99 68.99,9.8 68.78,9.8 IC1.49
JOY_UP  (via drill 0.2)
  Top 0.127: v79.18,11.13 86.59,11.13 90.01,14.55 91.48,14.55 S1.P$4
  Bottom 0.127: v79.18,11.13 76.53,8.47 72.76,8.47 69.27,4.98 69.06,4.98 68.78,4.7 IC1.51
MISO  (via drill 0.2)
  Top 0.127: 90.53,20.52 90.36,20.7 90.36,22.02 U1.2 | 90.53,20.52 91.06,20 91.06,18.67 R3.2 | R7.2 11.99,33.62 11.99,32.29 12.83,31.45 12.83,30.41 12.9,30.33 SD1.7 12.97,30.27 13.18,30.27 14.71,28.73 23.72,28.73 24.35,29.36 24.35,30.61 v24.49,30.75 | v60.19,13.08 60.19,14.97 59.07,16.09 58.09,16.09 55.99,18.18 v55.99,19.72 | v85.19,18.25 88.27,18.25 90.5,20.49 90.53,20.52
  Bottom 0.127: v60.19,13.08 60.19,11.06 | 60.19,11.06 60.19,3.93 58.58,2.33 58.58,2.19 IC1.14 | v55.99,19.72 55.99,25.17 53.9,27.26 53.41,27.26 TFT1.9 53.34,27.33 52.08,27.33 51.87,27.54 51.66,27.54 51.59,27.61 49.57,27.61 46.63,30.55 28.61,30.55 28.4,30.75 v24.49,30.75 | v85.19,18.25 79.6,18.25 74.92,13.57 71.78,13.57 69.27,11.06 60.19,11.06
MOSI  (via drill 0.2)
  Top 0.127: U1.5 92.88,27.19 92.88,25.86 94.27,24.47 94.27,17.62 93.85,17.2 85.61,17.2 84.07,18.74 84.07,19.58 R4.2 84,19.65 76.46,19.65 74.92,21.19 55.58,21.19 54.53,22.23 53.41,22.23 TFT1.7 | R6.2 26.24,33.62 26.24,32.22 25.61,31.59 25.61,30.55 25.4,30.33 SD1.2 25.61,30.47 v26.94,29.15
  Bottom 0.127: IC1.13 58.58,4.7 58.58,4.91 59.84,6.17 59.84,7.7 59.07,8.47 58.09,8.47 55.78,10.78 55.78,19.3 55.51,19.58 55.51,20.56 53.83,22.23 53.41,22.23 TFT1.7 53.34,22.3 52.29,22.3 45.45,29.15 v26.94,29.15
MOTOR  (via drill 0.2)
  Top 0.127: v74.85,14.13 74.85,13.57 73.88,12.59 73.88,12.31 IC1.19 | v74.64,23.42 74.36,23.7 73.32,23.7 72.55,24.47 72.55,25.52 71.78,26.28 70.73,26.28 66.96,30.06 v66.96,30.75 | v35.6,44.17 33.85,42.42 33.85,40.74 32.59,39.49 32.59,39.35 IDC1.16
  Bottom 0.127: v74.85,14.13 75.34,14.62 75.34,22.72 v74.64,23.42 | v66.96,30.75 66.96,30.96 53.55,44.38 35.81,44.38 v35.6,44.17
N$1
  Top 0.127: LED1.C 73.04,52.13 73.04,48.71 R1.1
N$2  (via drill 0.35)
  other vias: 46.6,22.24
N$3
  Top 0.127: R9.2 38.04,29.57 38.46,29.57 39.37,28.66 39.37,28.24 40,27.61 43.63,27.61 43.91,27.89 43.91,29.22 IC2.1
N$4
  Top 0.127: FB1.1 42.93,20.7 42.23,20.7 41.05,21.88 38.39,21.88 37.97,21.46 36.09,21.46 35.6,21.95 35.6,25.52 36.02,25.94 38.04,25.94 39.93,24.05 40.07,24.05 IC2.5
N$5
  Top 0.127: FB2.1 45.94,20.7 45.94,21.67 43.91,23.7 43.91,23.98 IC2.8
N$7  (via drill 0.2)
  Top 0.127: v64.94,10.57 64.94,12.8 65.7,13.57 66.68,13.57 67.45,14.34 67.45,15.32 68.22,16.09 69.27,16.09 71.5,18.32 v71.5,20.7
  Bottom 0.127: v64.94,10.57 64.94,4.07 66.19,2.81 66.19,2.19 IC1.31 | v71.5,20.7 71.5,20.91 72.55,21.95 72.55,23 73.25,23.7 74.3,23.7 75.06,24.47 75.06,25.52 74.3,26.28 73.25,26.28 72.55,26.98 72.55,28.03 73.32,28.8 74.3,28.8 77.3,31.8 77.3,38.3 77.79,38.79 77.79,39.62 BT1.2
N$8  (via drill 0.2)
  Top 0.127: v78.14,4.7 74.3,0.86 62.7,0.86 61.44,2.12 61.16,2.12 IC1.29
  Bottom 0.127: v78.14,4.7 78.14,6.73 97,25.58 97,38.37 97.83,39.21 97.83,39.62 BT1.1
N$15
  Top 0.127: LED2.C 37.27,5.12 37.27,12.38 37.13,12.52 R8.2
N$20
  Top 0.127: R11.2 40.98,32.64 40.98,31.52 40.07,30.61 40.07,29.29 IC2.4
N$21
  Top 0.127: R10.2 43.98,32.64 43.28,32.64 41.47,30.82 41.47,29.36 41.4,29.29 IC2.3
N$22
  Top 0.127: C11.1 38.04,34.6 40.98,34.6 R11.1
N$25  (via drill 0.2)
  Top 0.127: v45.17,34.11 44.75,34.53 44.05,34.53 R10.1 | v46.7,32.64 46.7,31.87 46.98,31.59 C10.1
  Bottom 0.127: v45.17,34.11 46.63,32.64 v46.7,32.64
N$26
  Top 0.127: C10.2 46.98,29.64 46.98,27.33 VR1.2
READ_DATA  (via drill 0.2)
  Top 0.127: v62.07,26.28 62.21,26.28 65.28,29.36 v65.28,29.5
  Bottom 0.127: v62.07,26.28 62.07,23.63 58.58,20.14 58.58,19.93 IC1.7 | v65.28,29.5 66.05,30.27 66.05,31.03 53.27,43.82 36.3,43.82 35.88,43.4 17.02,43.4 16.04,42.42 16.32,42.14 16.32,41.51 15.62,40.81 15.62,40.25 14.71,39.35 IDC1.30
RX1  (via drill 0.2)
  Top 0.127: v60.81,38.16 60.81,35.08 58.58,32.85 58.58,32.64 IC1.2
  Bottom 0.127: v60.81,38.16 60.6,38.16 53.83,44.93 7.31,44.93 3.05,40.67 2,40.67 JP2.1
SCK  (via drill 0.2)
  Top 0.127: v18.76,30.27 17.93,30.27 SD1.5 | v91.62,25.24 91.62,27.19 U1.6 | TFT1.8 53.34,24.75 52.01,23.42 51.94,23.42 51.59,23.07 51.59,21.39 52.01,20.97 52.29,20.97 52.57,20.7 54.25,20.7 54.53,20.97 55.37,20.97 57.67,18.67 59.07,18.67 64.45,13.29 64.45,9.73 65.7,8.47 66.68,8.47 67.45,7.7 67.45,6.73 68.22,5.96 69.75,5.96 73.53,2.19 73.81,2.19 IC1.15
  Bottom 0.127: v18.76,30.27 46.42,30.27 51.66,25.03 53.13,25.03 53.34,24.82 TFT1.8 | v91.62,25.24 91.62,20.63 73.81,2.81 73.81,2.19 IC1.15
SDCD  (via drill 0.2)
  Top 0.127: v23.09,33.06 22.95,32.92 22.95,32.64 23.65,31.94 23.65,30.33 SD1.CD
  Bottom 0.127: v23.09,33.06 29.45,33.06 31.48,35.08 48.17,35.08 52.08,31.17 54.74,31.17 58.37,27.54 58.51,27.54 IC1.4
SDCS  (via drill 0.2)
  Top 0.127: R8.1 37.13,14.55 37.13,20 28.12,29.01 28.12,30.06 27.91,30.27 SD1.1 27.98,30.27 v28.75,31.03 | v30.22,32.5 30.92,33.2 30.92,33.62 R5.1 30.99,33.69 31.48,33.69 v33.36,35.57
  Bottom 0.127: v28.75,31.03 v30.22,32.5 | v33.36,35.57 48.1,35.57 49.08,34.6 51.73,34.6 55.02,31.31 59.14,31.31 64.17,26.28 71.78,26.28 72.41,25.66 72.83,25.66 73.46,25.03 73.81,25.03 IC1.24
SDWP
  Top 0.127: SD1.WP 8.15,30.27 8.15,28.87 35.18,1.84 56.48,1.84 58.02,3.37 61.23,3.37 61.3,3.44 65.91,3.44 65.98,3.37 66.68,3.37 67.45,4.14 67.45,5.75 66.19,7.01 66.19,7.15 IC1.39
STEP  (via drill 0.2)
  Top 0.127: v72.62,19.58 72.62,19.3 73.6,18.32 73.6,18.25 73.81,18.04 73.81,17.41 IC1.21 | v46.49,34.11 46.49,34.25 42.79,37.95 32.03,37.95 31.76,38.23 28.61,38.23 27.5,39.35 IDC1.20
  Bottom 0.127: v72.62,19.58 71.71,18.67 61.65,18.67 59.35,16.37 57.81,16.37 56.48,17.69 56.48,26.91 54.81,28.59 54.53,28.59 54.25,28.31 52.57,28.31 52.29,28.59 52.01,28.59 v46.49,34.11
TFTCARD_CS
  Top 0.127: IC1.40 66.12,4.7 66.12,4.98 59.84,11.27 59.84,12.8 59.07,13.57 57.95,13.57 54.39,17.13 53.41,17.13 TFT1.5
TFTCS
  Bottom 0.127: IC1.12 58.51,7.22 58.51,7.49 55.51,10.5 55.51,17.69 54.74,18.46 54.53,18.46 53.34,19.65 TFT1.6
TFTDC  (via drill 0.2)
  Top 0.127: v56.27,14.62 55.44,14.62 55.3,14.76 54.95,14.76 54.88,14.69 53.41,14.69 TFT1.4
  Bottom 0.127: v56.27,14.62 57.74,16.09 69.75,16.09 73.53,19.86 73.81,19.86 IC1.22
TFTRESET  (via drill 0.2)
  Top 0.127: v56.27,13.57 55.99,13.57 54.53,12.1 53.41,12.1 TFT1.3
  Bottom 0.127: v56.27,13.57 69.27,13.57 70.03,14.34 70.03,15.39 73.32,18.67 74.36,18.67 75.06,19.37 75.06,20.49 74.02,21.53 74.02,21.6 73.88,21.74 73.88,22.44 IC1.23
TRACK0  (via drill 0.2)
  Top 0.127: v51.73,18.74 52.01,18.46 54.74,18.46 58.3,14.9 58.51,14.9 IC1.9 | v49.71,28.1 v49.71,24.26 | v35.46,34.11 31.62,37.95 21.28,37.95 19.88,39.35 IDC1.26
  Bottom 0.127: v51.73,18.74 49.71,20.77 v49.71,24.26 | v49.71,28.1 49.5,28.1 43.49,34.11 v35.46,34.11
TX1  (via drill 0.2)
  Top 0.127: v52.71,23.49 54.74,23.49 55.51,24.26 55.51,26.28 58.37,29.15 58.37,29.22 58.51,29.36 58.51,30.06 IC1.3 | v17.02,30.69 16.53,31.17 16.53,31.45 15.76,32.22 13.87,32.22 13.18,32.92 13.18,34.6 10.66,37.11 3.96,37.11 3.05,38.02 2,38.02 JP2.2
  Bottom 0.127: v52.71,23.49 51.52,23.49 45.24,29.78 17.93,29.78 v17.02,30.69
VBUS
  Top 0.35: LED1.A 75.13,52.13 75.13,50.94 76.39,49.68 76.39,41.3 74.36,39.28 74.36,38.44 74.08,38.16 C1.2 74.16,38.02 74.16,36.55 | 74.16,36.55 74.22,36.48 74.22,36.41 73.81,35.99 IC1.28 | 74.16,36.55 74.02,36.62 65.84,36.62 63.82,38.65 63.47,38.65 J1.VBUS 63.33,38.72 62.77,38.72 62.63,38.58 62.42,38.58 62.35,38.51 62.14,38.51 61.93,38.72 56.06,38.72 C3.1 55.85,38.72 51.94,38.72 46.15,32.92 46.01,32.92 45.45,32.36 45.45,28.45 42.93,25.94 41.4,25.94 41.19,25.72 41.08,25.62 | JP1.1 2,50.31 2.35,50.31 4.23,48.43 4.23,47.17 3.26,46.19 3.26,45 C4.1 3.33,44.79 3.33,43.61 9.4,37.53 24.63,37.53 27.7,34.46 27.7,32.64 28.47,31.87 32.94,31.87 36.78,28.03 37.69,28.03 37.9,27.82 R9.1 38.04,27.68 39.02,27.68 41.08,25.62 | C12.1 37.06,22.72 39.09,22.72 39.51,22.3 40.91,22.3 41.26,22.65 41.26,22.86 41.33,22.93 41.33,23.98 IC2.6 41.4,24.19 41.4,25.03 41.26,25.17 41.26,25.45 41.08,25.62
VO+
  Top 0.127: FB1.2 42.93,18.67 40.07,18.67 C14.1 40,18.67 40,15.67 SPK1.P$2
VO-
  Top 0.127: FB2.2 46.01,18.67 48.45,18.67 48.59,18.53 C13.1 48.59,18.46 48.59,17.13 49.36,16.37 49.36,15.25 SPK1.P$1
WRITE_DATA  (via drill 0.2)
  Top 0.127: v51.38,5.61 54.74,5.61 55.37,6.24 55.37,6.31 58.51,9.45 58.51,9.73 IC1.11
  Bottom 0.127: v51.38,5.61 51.38,5.75 28.47,28.66 18.41,28.66 16.53,30.55 16.53,30.82 24.98,39.28 IDC1.22
WRITE_ENABLE  (via drill 0.2)
  Top 0.127: v50.06,6.45 51.94,8.33 52.22,8.33 52.36,8.47 54.46,8.47 54.6,8.33 54.88,8.33 58.51,11.97 58.51,12.24 IC1.10
  Bottom 0.127: v50.06,6.45 40.21,6.45 16.25,30.41 16.25,33.13 22.4,39.28 IDC1.24
WRITE_PROTECT  (via drill 0.2)
  Top 0.127: v62.56,27.26 62.56,27.4 v65.28,30.13
  Bottom 0.127: v62.56,27.26 62.56,22.09 58.79,18.32 58.79,18.25 58.58,18.04 58.58,17.41 IC1.8 | v65.28,30.13 65.77,30.61 65.77,30.89 53.13,43.54 36.44,43.54 36.02,43.12 19.25,43.12 18.55,42.42 18.55,40.67 17.37,39.49 17.37,39.35 IDC1.28

### Text on the board
tPlace: FLOPPY POWER | SERIAL TTL | AKSEVENFOUR | ADFCOPY v0.5 07/2018 | -